# EAGLE schematic christmas_card (EAGLE 9.6.2)
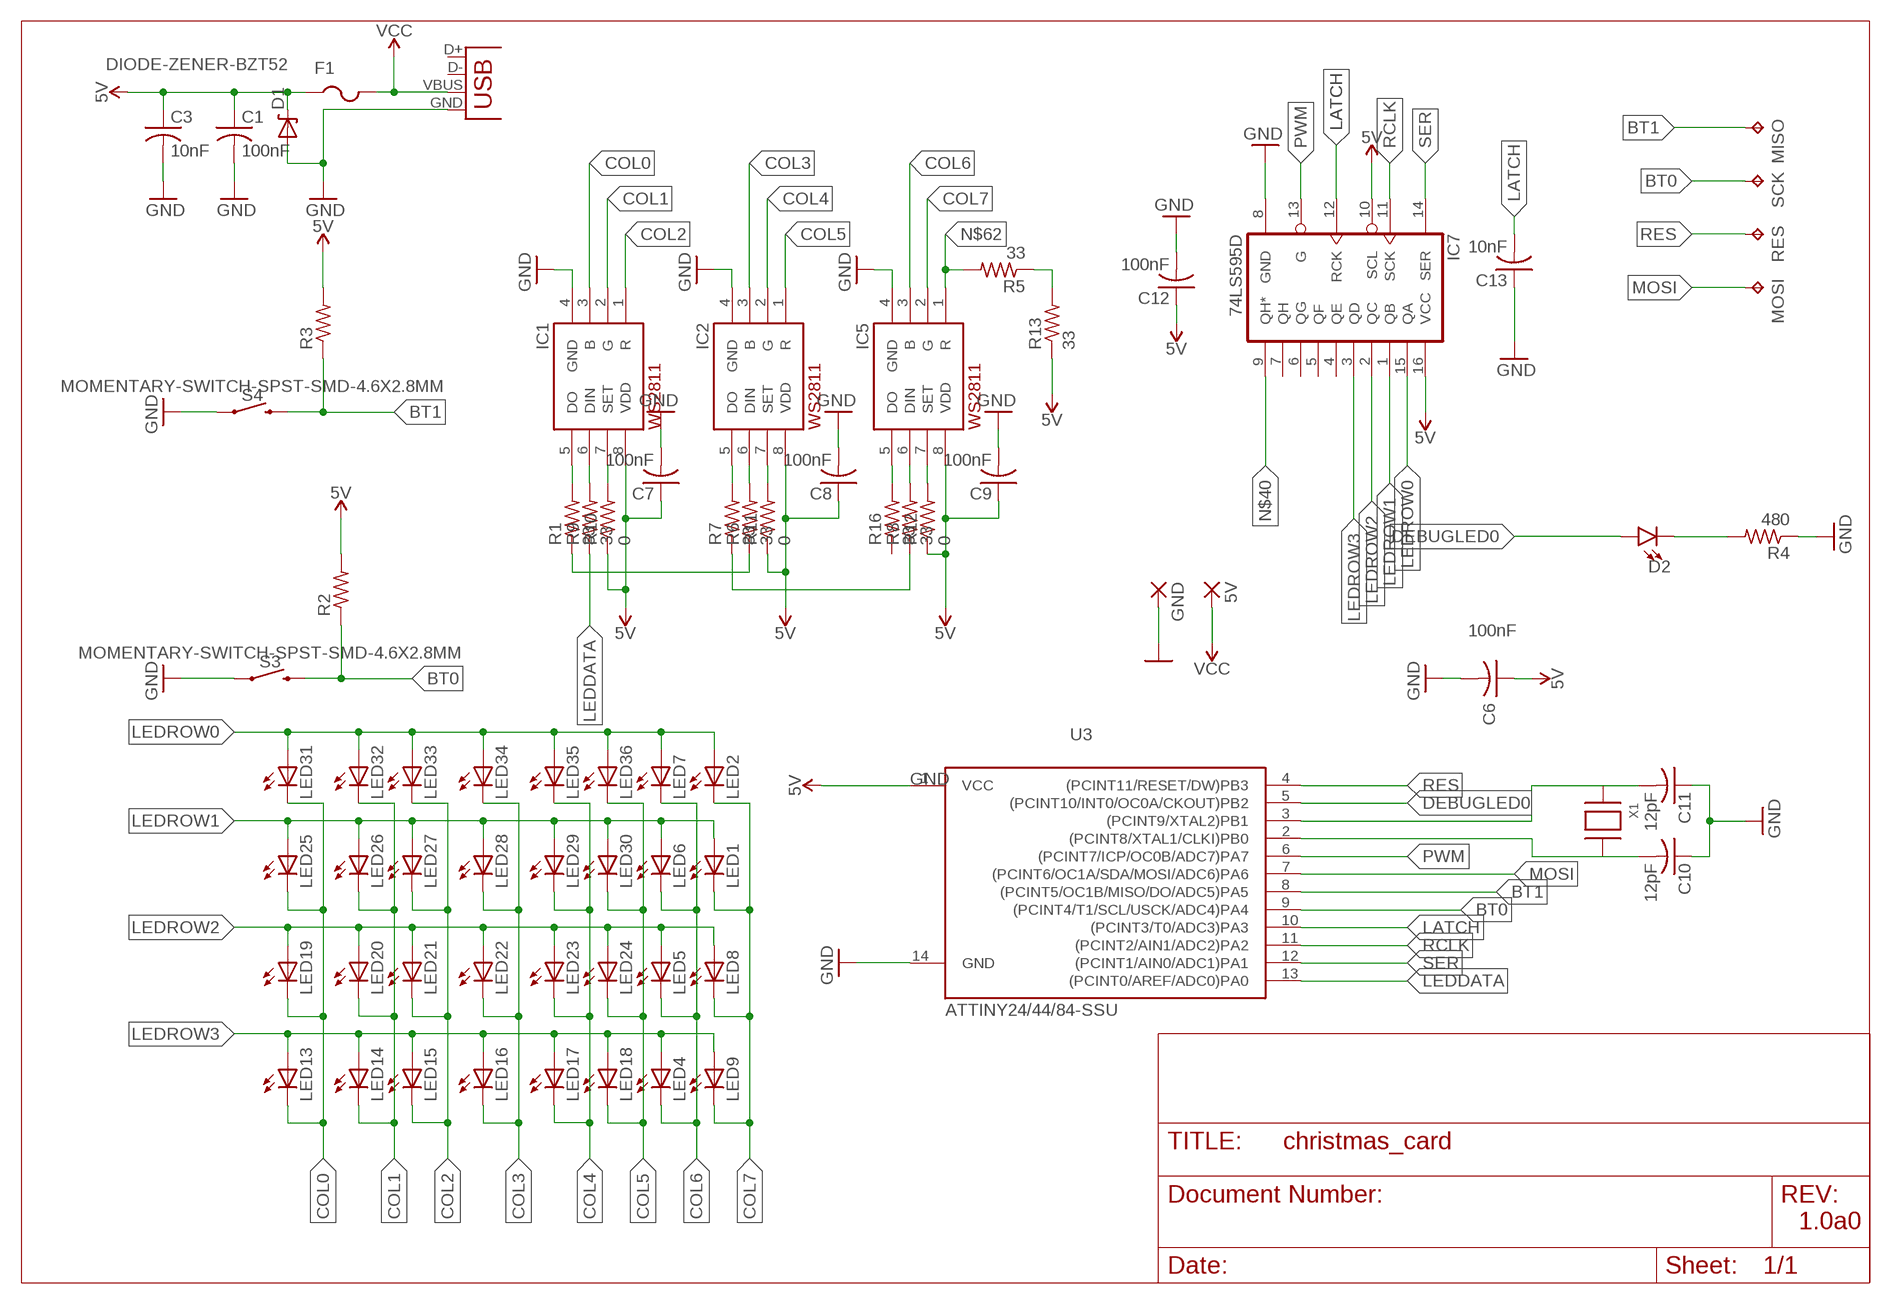
[diagram p0: schematic, sheet 1]

## Parts
5V  WIREPADSMD2,54-5,08  [SMD2,54-5,08]
C1  100nF  C-USC0603  [C0603]
C3  10nF  C-USC0603  [C0603]
C6  100nF  C-USC0603  [C0603]
C7  100nF  C-USC0603  [C0603]
C8  100nF  C-USC0603  [C0603]
C9  100nF  C-USC0603  [C0603]
C10  12pF  C-USC0603  [C0603]
C11  12pF  C-USC0603  [C0603]
C12  100nF  C-USC0603  [C0603]
C13  10nF  C-USC0603  [C0603]
D1  DIODE-ZENER-BZT52  [SOD-323]
D2  LED0603  [LED-0603]
F1  PTCFUSE-1206  [R1206]
GND  WIREPADSMD2,54-5,08  [SMD2,54-5,08]
IC1  WS2811-SOP8  [SO08-SKINNYPADS]
IC2  WS2811-SOP8  [SO08-SKINNYPADS]
IC5  WS2811-SOP8  [SO08-SKINNYPADS]
IC7  74LS595D  [SO16]
LED1  LED1206  [LED-1206]
LED2  LED1206  [LED-1206]
LED4  LED1206  [LED-1206]
LED5  LED1206  [LED-1206]
LED6  LED1206  [LED-1206]
LED7  LED1206  [LED-1206]
LED8  LED1206  [LED-1206]
LED9  LED1206  [LED-1206]
LED13  LED1206  [LED-1206]
LED14  LED1206  [LED-1206]
LED15  LED1206  [LED-1206]
LED16  LED1206  [LED-1206]
LED17  LED1206  [LED-1206]
LED18  LED1206  [LED-1206]
LED19  LED1206  [LED-1206]
LED20  LED1206  [LED-1206]
LED21  LED1206  [LED-1206]
LED22  LED1206  [LED-1206]
LED23  LED1206  [LED-1206]
LED24  LED1206  [LED-1206]
LED25  LED1206  [LED-1206]
LED26  LED1206  [LED-1206]
LED27  LED1206  [LED-1206]
LED28  LED1206  [LED-1206]
LED29  LED1206  [LED-1206]
LED30  LED1206  [LED-1206]
LED31  LED1206  [LED-1206]
LED32  LED1206  [LED-1206]
LED33  LED1206  [LED-1206]
LED34  LED1206  [LED-1206]
LED35  LED1206  [LED-1206]
LED36  LED1206  [LED-1206]
MISO  TPB1,27  [B1,27]
MOSI  TPB1,27  [B1,27]
R1  33  R-US_R0603  [R0603]
R2  R-US_R0603  [R0603]
R3  R-US_R0603  [R0603]
R4  480  R-US_R0603  [R0603]
R5  33  R-US_R0603  [R0603]
R6  33  R-US_R0603  [R0603]
R7  33  R-US_R0603  [R0603]
R8  33  R-US_R0603  [R0603]
R9  33  R-US_R0603  [R0603]
R10  0  R-US_R0603  [R0603]
R11  0  R-US_R0603  [R0603]
R12  0  R-US_R0603  [R0603]
R13  33  R-US_R0603  [R0603]
R16  33  R-US_R0603  [R0603]
RES  TPB1,27  [B1,27]
S3  MOMENTARY-SWITCH-SPST-SMD-4.6X2.8MM  [TACTILE_SWITCH_SMD_4.6X2.8MM]
S4  MOMENTARY-SWITCH-SPST-SMD-4.6X2.8MM  [TACTILE_SWITCH_SMD_4.6X2.8MM]
SCK  TPB1,27  [B1,27]
U3  ATTINY24/44/84-SSU  [SOIC14N]
X1  XTALNX5032  [NX5032]
X2  USB-MICROB  [USB-MICROB]

## Nets
5V: C1.1 C3.1 C6.1 C7.1 C8.1 C9.1 C12.1 D1.1(C) F1.1 IC1.8(VDD) IC2.8(VDD) IC5.8(VDD) IC7.10(SCL) IC7.16(VCC) R2.2 R3.2 R10.1 R11.1 R12.1 R13.1 U3.1(VCC)
BT0: R2.1 S3.3 S3.4 SCK.TP U3.9((PCINT4/T1/SCL/USCK/ADC4)PA4)
BT1: MISO.TP R3.1 S4.3 S4.4 U3.8((PCINT5/OC1B/MISO/DO/ADC5)PA5)
COL0: IC1.3(B) LED13.C LED19.C LED25.C LED31.C
COL1: IC1.2(G) LED14.C LED20.C LED26.C LED32.C
COL2: IC1.1(R) LED15.C LED21.C LED27.C LED33.C
COL3: IC2.3(B) LED16.C LED22.C LED28.C LED34.C
COL4: IC2.2(G) LED17.C LED23.C LED29.C LED35.C
COL5: IC2.1(R) LED18.C LED24.C LED30.C LED36.C
COL6: IC5.3(B) LED4.C LED5.C LED6.C LED7.C
COL7: IC5.2(G) LED1.C LED2.C LED8.C LED9.C
DEBUGLED0: D2.A U3.5((PCINT10/INT0/OC0A/CKOUT)PB2)
GND: C1.2 C3.2 C6.2 C7.2 C8.2 C9.2 C10.1 C11.1 C12.2 C13.1 D1.2(A) GND.1(P) IC1.4(GND) IC2.4(GND) IC5.4(GND) IC7.8(GND) R4.1 S3.1 S3.2 S4.1 S4.2 U3.14(GND) X2.GND
LATCH: C13.2 IC7.12(RCK) U3.10((PCINT3/T0/ADC3)PA3)
LEDDATA: R9.1 U3.13((PCINT0/AREF/ADC0)PA0)
LEDROW0: IC7.15(QA) LED2.A LED7.A LED31.A LED32.A LED33.A LED34.A LED35.A LED36.A
LEDROW1: IC7.1(QB) LED1.A LED6.A LED25.A LED26.A LED27.A LED28.A LED29.A LED30.A
LEDROW2: IC7.2(QC) LED5.A LED8.A LED19.A LED20.A LED21.A LED22.A LED23.A LED24.A
LEDROW3: IC7.3(QD) LED4.A LED9.A LED13.A LED14.A LED15.A LED16.A LED17.A LED18.A
MOSI: MOSI.TP U3.7((PCINT6/OC1A/SDA/MOSI/ADC6)PA6)
N$1: R1.1 R6.1
N$2: IC1.5(DO) R1.2
N$3: IC2.6(DIN) R6.2
N$4: IC2.5(DO) R7.2
N$5: R7.1 R8.1
N$6: IC5.6(DIN) R8.2
N$7: IC1.6(DIN) R9.2
N$8: IC5.7(SET) R12.2
N$9: D2.C R4.2
N$10: C10.2 U3.2((PCINT8/XTAL1/CLKI)PB0) X1.P$2
N$11: IC5.5(DO) R16.2
N$12: R5.1 R13.2
N$14: C11.2 U3.3((PCINT9/XTAL2)PB1) X1.P$1
N$35: IC2.7(SET) R11.2
N$36: IC1.7(SET) R10.2
N$40: IC7.9(QH*)
N$62: IC5.1(R) R5.2
PWM: IC7.13(G) U3.6((PCINT7/ICP/OC0B/ADC7)PA7)
RCLK: IC7.11(SCK) U3.11((PCINT2/AIN1/ADC2)PA2)
RES: RES.TP U3.4((PCINT11/RESET/DW)PB3)
SER: IC7.14(SER) U3.12((PCINT1/AIN0/ADC1)PA1)
VCC: 5V.1(P) F1.2 X2.VBUS
Unconnected: IC7.4(QE) IC7.5(QF) IC7.6(QG) IC7.7(QH) R16.1 X2.D+ X2.D-

## Notes on the sheet
- 1.0a0

## Library data of the parts
5V GND = wirepad:WIREPAD: Wire PAD connect wire on PCB
C1 C3 C6-C13 = adafruit:C-US: CAPACITOR, American symbol
D1 = SparkFun:DIODE-ZENER: Zener Diode Production Part - 8199 3.4V Zener Voltage
D2 = SparkFun-LED:LED: LED (Generic) Standard schematic elements and footprints for 5mm, 3mm, 1206, and 0603 sized LEDs. Generic LEDs with no color specified.
F1 = adafruit:PTCFUSE: PTC fuses, resettable thermistors
IC1 IC2 IC5 = adafruit:WS2811
IC7 = SparkFun:74*595: 8-bit SHIFT REGISTER, output latch; SPICEPREFIX: X
LED1 LED2 LED4-LED9 LED13-LED36 = SparkFun:LED: LEDs Standard schematic elements and footprints for 5mm, 3mm, 1206, and 0603 sized LEDs. 5mm - Spark Fun Electronics SKU : COM-00529 (and others)
MISO MOSI RES SCK = testpad:TP: Test pad
R1-R13 R16 = adafruit:R-US_: RESISTOR, American symbol
S3 S4 = SparkFun-Switches:MOMENTARY-SWITCH-SPST: Momentary Switch (Pushbutton) - SPST Normally-open (NO) SPST momentary switches (buttons, pushbuttons). Variants PTH-12MM - 12mm square, through-hole Momentary Pushbutton Switch - 12mm Square <https://www.sparkfun.com/products/9190> (COM-09190) PTH-6.0MM, PTH-6.0MM-KIT - 6.0mm square, through-hole Mini Pushbutton Switch <https://www.sparkfun.com/products/97> (COM-00097) KIT package intended for soldering kit's - only one side of pads' copper is exposed. PTH-RIGHT-ANGLE-KIT - Right-angle, through-hole Right Angle Tactile Button <https://www.sparkfun.com/products/10791> - Used on SparkFun BigTime Watch Kit <https://www.sparkfun.com/products/11734> SMD-12MM - 12mm square, surface-mount Tactile Button - SMD (12mm) <https://www.sparkfun.com/products/12993> (COM-12993) Used on SparkFun PicoBoard <https://www.sparkfun.com/products/11888> SMD-4.5MM - 4.5mm Square Trackball Switch Used on SparkFun Blackberry Trackballer Breakout <https://www.sparkfun.com/products/13169> SMD-4.6MMX2.8MM - 4.60mm x 2.80mm, surface mount Used on SparkFun Pro Micro - RP2040 <https://www.sparkfun.com/products/17717> SMD-5.2MM, SMD-5.2-REDUNDANT - 5.2mm square, surface-mount Mini Pushbutton Switch - SMD <https://www.sparkfun.com/products/8720> (COM-08720) Used on Arduino Pro Mini <https://www.sparkfun.com/products/11114> REDUNDANT package connects both switch circuits together SMD-6.0X3.5MM - 6.0 x 3.5mm, surface mount Momentary Reset Switch SMD <https://www.sparkfun.com/products/8229> (COM-08229) SMD-6.2MM-TALL - 6.2mm square, surface mount Tactile Button - SMD (6mm) <https://www.sparkfun.com/products/12992> Used on SparkFun Digital Sandbox <https://www.sparkfun.com/products/12651> SMD-RIGHT-ANGLE - Right-angle, surface mount Used on SparkFun Block for Intel® Edison - Arduino <https://www.sparkfun.com/products/13036>; PROD_ID: SWCH-15606
U3 = bt_avr:ATTINY24/44/84: Atmel AVR ATtiny24/44/84 14-pin High Performance, Low Power AVR® 8-bit Microcontroller
X1 = adafruit:XTAL: Low cost SMT crystals, no capacitors included http://www.ladyada.net/library/eagle
X2 = SparkFun:USB: USB Connectors USB-B-PTH is fully proven SKU : PRT-00139 USB-miniB is fully proven SKU : PRT-00587 USB-A-PCB is untested. USB-A-H is throughly reviewed, but untested. Spark Fun Electronics SKU : PRT-00437 USB-B-SMT is throughly reviewed, but untested. Needs silkscreen touching up. USB-A-S has not been used/tested USB-MB-H has not been used/tested